# EAGLE design OvveMatrix (EAGLE 9.6.2)
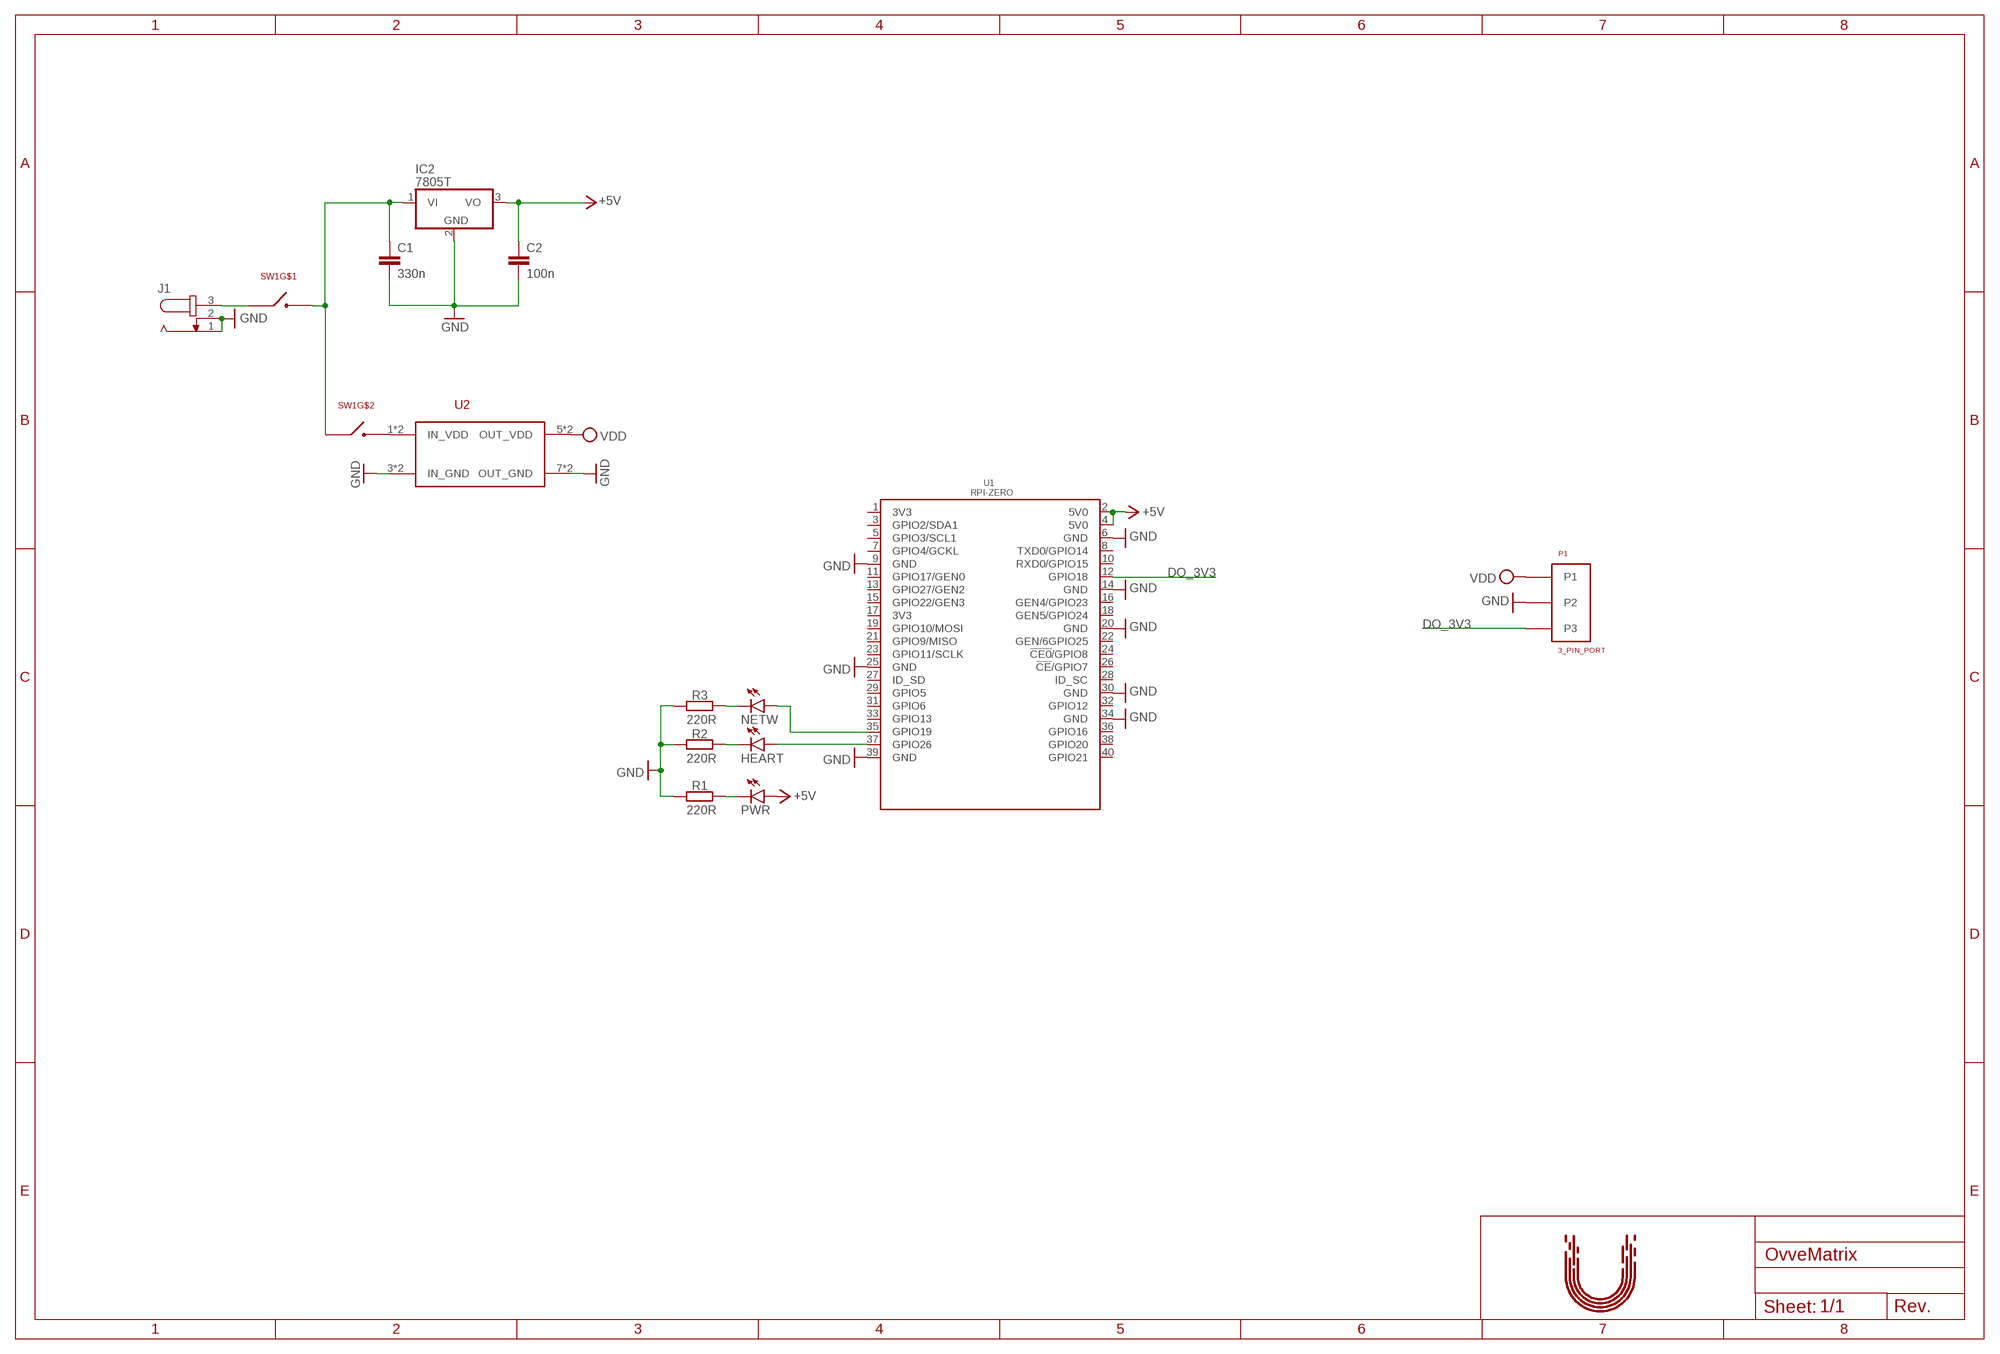
[diagram p0: schematic, sheet 1]

## Parts
C1  330n  CAPACITOR0805  [C0805]
C2  100n  CAPACITOR0805  [C0805]
HEART  LEDLED_THROUGH  [LED3MM]
IC2  7805T  [TO220H]
J1  JACK-PLUG0  [SPC4077]
NETW  LEDLED_THROUGH  [LED3MM]
P1  3_PIN_PORT  [3_PIN_PORT]
PWR  LEDLED_THROUGH  [LED3MM]
R1  220R  RESISTOR0805  [R0805]
R2  220R  RESISTOR0805  [R0805]
R3  220R  RESISTOR0805  [R0805]
SW1  DOUBLE_SWITCH  [DOUBLE_SWITCH]
U1  RPI-ZERO  [RASPBERRYPI_BASTELSTUBE_V13_RASPI_BOARD_B+_FULL]
U2  BUCK  [BUCK]
U$1  UTBULT_DESIGN4  [UD_4]

## Nets
+5V: C2.1 IC2.3(VO) PWR.A U1.2(5V0) U1.4(5V0)
DO_3V3: P1.P$3(P3) U1.12(GPIO18)
GND: C1.2 C2.2 IC2.2(GND) J1.1 J1.2 P1.P$2(P2) R1.1 R2.1 R3.1 U1.6(GND) U2.3(IN_GND) U2.4(IN_GND) U2.7(OUT_GND) U2.8(OUT_GND)
GND@1: U1.9(GND) ; supply symbol labelled GND
GND@2: U1.25(GND) ; supply symbol labelled GND
GND@3: U1.39(GND) ; supply symbol labelled GND
GND@4: U1.14(GND) ; supply symbol labelled GND
GND@5: U1.20(GND) ; supply symbol labelled GND
GND@6: U1.30(GND) ; supply symbol labelled GND
GND@7: U1.34(GND) ; supply symbol labelled GND
N$1: SW1.4 U2.1(IN_VDD) U2.2(IN_VDD)
N$2: NETW.K(C) R3.2
N$3: HEART.K(C) R2.2
N$4: HEART.A U1.37(GPIO26)
N$5: PWR.K(C) R1.2
N$6: C1.1 IC2.1(VI) SW1.2 SW1.3
N$7: NETW.A U1.35(GPIO19)
N$8: J1.3 SW1.1
VDD: P1.P$1(P1) U2.5(OUT_VDD) U2.6(OUT_VDD)
Unconnected: U1.1(3V3) U1.3(GPIO2/SDA1) U1.5(GPIO3/SCL1) U1.7(GPIO4/GCKL) U1.8(TXD0/GPIO14) U1.10(RXD0/GPIO15) U1.11(GPIO17/GEN0) U1.13(GPIO27/GEN2) U1.15(GPIO22/GEN3) U1.16(GEN4/GPIO23) U1.17(3V3) U1.18(GEN5/GPIO24) U1.19(GPIO10/MOSI) U1.21(GPIO9/MISO) U1.22(GEN/6GPIO25) U1.23(GPIO11/SCLK) U1.24(!CE0!/GPIO8) U1.26(!CE!/GPIO7) U1.27(ID_SD) U1.28(ID_SC) U1.29(GPIO5) U1.31(GPIO6) U1.32(GPIO12) U1.33(GPIO13) U1.36(GPIO16) U1.38(GPIO20) U1.40(GPIO21)

## Library data of the parts
C1 C2 = lib:CAPACITOR: Capacitor
HEART NETW PWR = lib:LED
IC2 = lib:78*: Positive VOLTAGE REGULATOR
J1 = lib:JACK-PLUG: DC POWER JACK Power Jack, DC, Right Angle, Through Hole, Rated 5A at 16VDC, PC Terminals Distributor: Farnell (www.Farnell.de) Drawing: 84N1161.pdf / 84N1162.pdf Manufacturer: SPC Technology (www.spctechnology.com) Type: SPC4077 / SPC 4078; OC_FARNELL: unknown; OC_NEWARK: unknown
P1 = lib:3_PIN_PORT
R1-R3 = lib:RESISTOR
SW1 = lib:DOUBLE_SWITCH
U1 = lib:RPI-ZERO
U2 = lib:BUCK
U$1 = lib:UTBULT_DESIGN

## Board
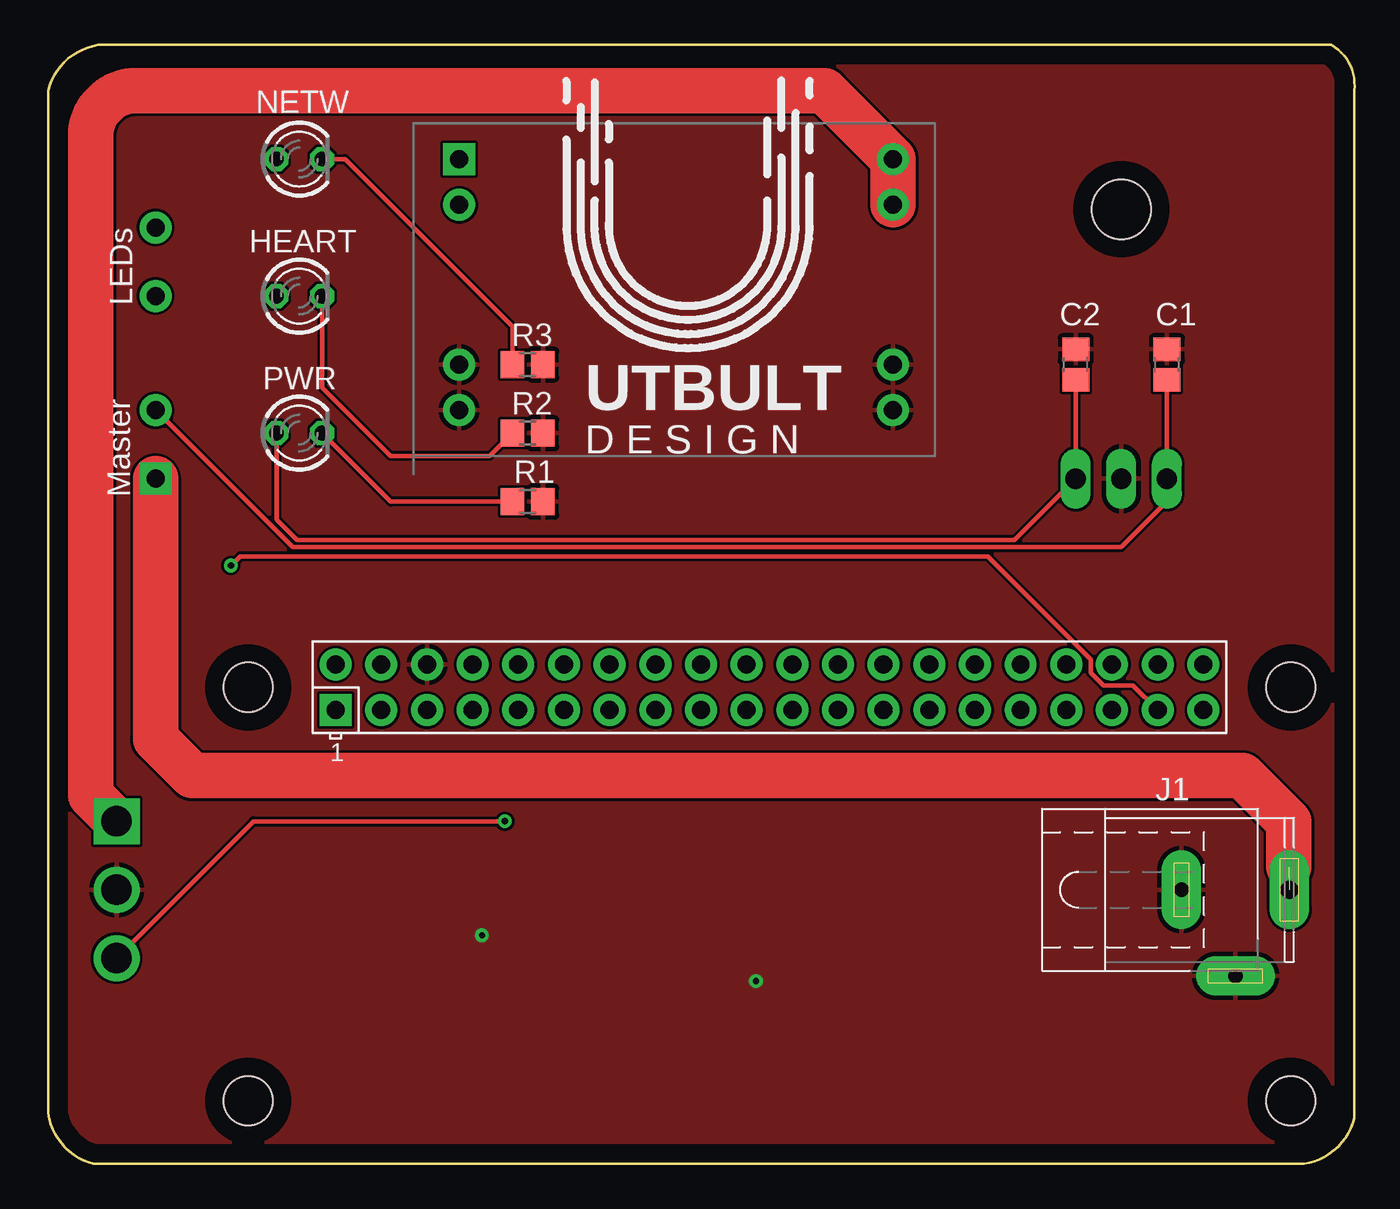
[diagram p1: board, top side]
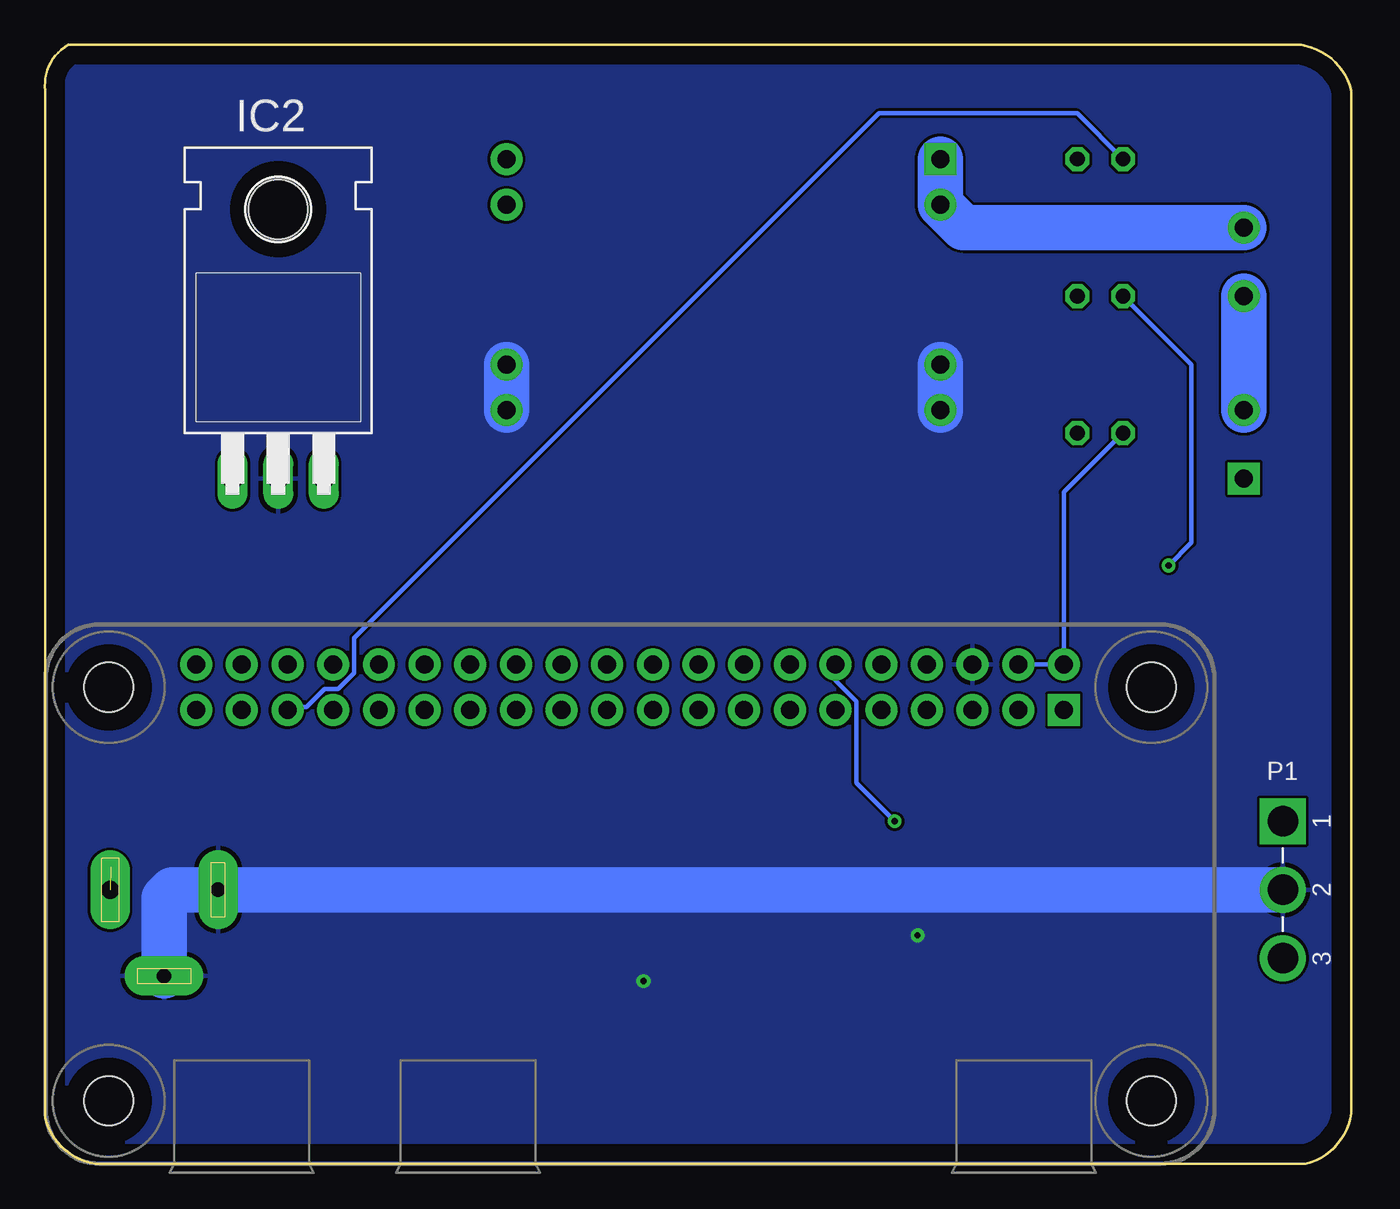
[diagram p2: board, bottom side, seen from below]

Size 72.66 x 62.23 mm. Coordinates in mm from the lower left corner, seen from the top.
Outline: 2.54,0 69.85,0 arc67 72.64,2.54 72.64,59.69 arc67 71.37,62.23 2.79,62.23 arc67 0,59.69 0,2.79 arc67 2.54,0
Copper layers (1*16): Top 0.035mm / dielectric 1.5mm / Bottom 0.035mm
Design rules "default": minimum track width 6mil, minimum drill 0.35mm, track to track 6mil, track to pad 6mil, pad to pad 6mil, via to via 6mil, smd to smd 6mil, copper to edge 40mil, drill to drill 6mil, minimum pad ring 10mil, minimum via ring 8mil, stop-mask expansion 4mil, vias tented up to drill 0mil, thermal gap 10mil

### Footprints (pad centres in the part's own frame; a part is rotated, then mirrored left to right if it is on the bottom)
C0805 = smd 1.3 x 1.5: 1 -0.85,0; 2 0.85,0
LED3MM = drill 0.813 octagon: A -1.27,0; K 1.27,0
TO220H = drill 1.118 long: 1 -2.54,-10.16; 2 0,-10.16; 3 2.54,-10.16 | hole 3.302: 0,4.826
SPC4077 = drill 0.8 pad 2.184 long: 1 -3,0; 2 0,-4.8 | drill 1 pad 2.184 long: 3 3,0
3_PIN_PORT = drill 1.702 square: P$1 0,0 | drill 1.702: P$2 3.81,0; P$3 7.62,0
R0805 = smd 1.3 x 1.5: 1 -0.85,0; 2 0.85,0
DOUBLE_SWITCH = drill 1 pad 1.778 square: 1 0,3.81 | drill 1 pad 1.778: 2 0,0; 3 0,-6.35; 4 0,-10.16
RASPBERRYPI_BASTELSTUBE_V13_RASPI_BOARD_B+_FULL = drill 1 pad 1.778 square: 1 8.37,25.23 | drill 1 pad 1.778: 2 8.37,27.77; 3 10.91,25.23; 4 10.91,27.77; 5 13.45,25.23; 6 13.45,27.77; 7 15.99,25.23; 8 15.99,27.77; 9 18.53,25.23; 10 18.53,27.77; 11 21.07,25.23; 12 21.07,27.77; 13 23.61,25.23; 14 23.61,27.77; 15 26.15,25.23; 16 26.15,27.77; 17 28.69,25.23; 18 28.69,27.77; 19 31.23,25.23; 20 31.23,27.77; 21 33.77,25.23; 22 33.77,27.77; 23 36.31,25.23; 24 36.31,27.77; 25 38.85,25.23; 26 38.85,27.77; 27 41.39,25.23; 28 41.39,27.77; 29 43.93,25.23; 30 43.93,27.77; 31 46.47,25.23; 32 46.47,27.77; 33 49.01,25.23; 34 49.01,27.77; 35 51.55,25.23; 36 51.55,27.77; 37 54.09,25.23; 38 54.09,27.77; 39 56.63,25.23; 40 56.63,27.77 | hole 2.75: 3.5,3.5; 3.5,26.5; 61.5,3.5; 61.5,26.5
BUCK = drill 1 pad 1.778 square: 1 2.54,16.51 | drill 1 pad 1.778: 2 2.54,13.97; 3 2.54,5.08; 4 2.54,2.54; 5 26.67,16.51; 6 26.67,13.97; 7 26.67,5.08; 8 26.67,2.54

### Placement (x,y rotation side)
C1  62.23,44.45 90 top
C2  57.15,44.45 90 top
HEART  13.97,48.26 0 top
IC2  59.69,48.26 0 bottom
J1  66.04,15.24 0 top
NETW  13.97,55.88 0 top
P1  3.81,19.05 270 bottom
PWR  13.97,40.64 0 top
R1  26.67,36.83 180 top
R2  26.67,40.64 180 top
R3  26.67,44.45 180 top
SW1  5.97,41.91 180 top
U1  7.62,0 0 top
U2  20.32,39.37 0 top
U$1  35.56,53.34 0 top

### Tracks (layer width: path | path; a pad name or v marks a point on that pad's centre or on a via)
+5V
  Top 0.254: C2.1 IC2.3 53.75,34.7 13.84,34.7 12.7,35.84 PWR.A
  Bottom 0.254: PWR.A 15.99,37.35 U1.2 U1.4
DO_3V3  (via drill 0.35)
  Top 0.254: P1.P$3 11.43,19.05 v25.4,19.05
  Bottom 0.254: U1.12 28.69,26.88 27.52,25.71 27.52,21.17 v25.4,19.05
GND  (via drill 0.35)
  Bottom 2.54: J1.2 66.04,14.78 65.58,15.24 J1.1 P1.P$2 | U2.8 U2.7 | U2.3 U2.4
  other vias: 24.13,12.7 39.37,10.16
  pour Bottom: -2.54,63.5 74.93,63.5 74.93,-1.27 -2.54,-1.27
  pour Top: -2.54,63.5 74.93,63.5 74.93,-1.27 -2.54,-1.27
N$1
  Bottom 2.54: SW1.4 21.59,52.07 U2.2 U2.1
N$2
  Top 0.254: NETW.K 16.51,55.88 25.82,46.57 R3.2
N$3
  Top 0.254: HEART.K 15.24,43.18 19.05,39.37 24.55,39.37 R2.2
N$4  (via drill 0.35)
  Top 0.254: U1.37 60.34,26.6 58.69,26.6 58,27.29 58,28.05 52.27,33.78 10.67,33.78 v10.16,33.27
  Bottom 0.254: v10.16,33.27 8.89,34.54 8.89,44.45 HEART.A
N$5
  Top 0.254: R1.2 19.05,36.83 PWR.K
N$6
  Top 0.254: SW1.2 13.59,34.29 59.69,34.29 62.23,36.83 IC2.1 C1.1
  Bottom 2.54: SW1.3 SW1.2
N$7
  Bottom 0.254: U1.35 59.17,25.4 58.11,25.4 57.11,26.4 56.35,26.4 55.46,27.29 55.46,29.25 26.29,58.42 15.24,58.42 NETW.A
N$8  (1 unrouted)
  Top 2.54: 69.01,16.51 69.01,19 66.42,21.59 8,21.59 5.97,23.62 SW1.1
VDD
  Top 2.54: U2.6 U2.5 43.18,59.69 4.9,59.69 arc90 2.36,57.15 2.36,20.5 P1.P$1